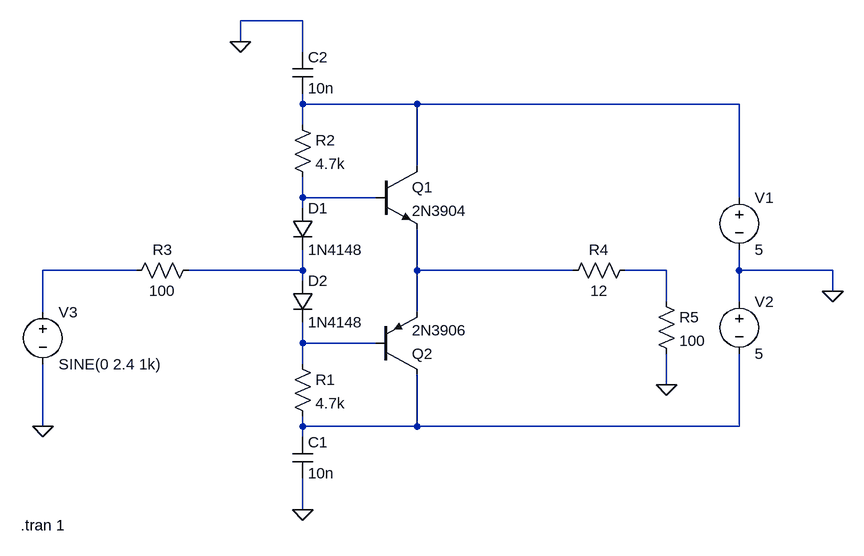
[diagram p0: schematic Push pull amplifier Type AB.asc]
Push pull amplifier Type AB.asc, the LTspice schematic file:
Version 4
SHEET 1 916 680
WIRE 80 -176 -16 -176
WIRE -16 -144 -16 -176
WIRE 80 -128 80 -176
WIRE 80 -48 80 -64
WIRE 256 -48 80 -48
WIRE 752 -48 256 -48
WIRE 80 -16 80 -48
WIRE 256 48 256 -48
WIRE 80 96 80 64
WIRE 192 96 80 96
WIRE 752 96 752 -48
WIRE 80 112 80 96
WIRE -176 208 -320 208
WIRE 80 208 80 176
WIRE 80 208 -96 208
WIRE 256 208 256 144
WIRE 496 208 256 208
WIRE 640 208 576 208
WIRE 752 208 752 176
WIRE 896 208 752 208
WIRE 80 224 80 208
WIRE 896 240 896 208
WIRE 640 256 640 208
WIRE 752 256 752 208
WIRE -320 272 -320 208
WIRE 256 272 256 208
WIRE 80 320 80 288
WIRE 192 320 80 320
WIRE 80 352 80 320
WIRE 640 384 640 336
WIRE -320 448 -320 352
WIRE 80 448 80 432
WIRE 256 448 256 368
WIRE 256 448 80 448
WIRE 752 448 752 336
WIRE 752 448 256 448
WIRE 80 464 80 448
WIRE 80 576 80 528
FLAG -16 -144 0
FLAG 80 576 0
FLAG 896 240 0
FLAG 640 384 0
FLAG -320 448 0
SYMBOL npn 192 48 R0
SYMATTR InstName Q1
SYMATTR Value 2N3904
SYMBOL pnp 192 368 M180
SYMATTR InstName Q2
SYMATTR Value 2N3906
SYMBOL res 64 336 R0
SYMATTR InstName R1
SYMATTR Value 4.7k
SYMBOL res 64 -32 R0
SYMATTR InstName R2
SYMATTR Value 4.7k
SYMBOL res -80 192 R90
WINDOW 0 0 56 VBottom 2
WINDOW 3 32 56 VTop 2
SYMATTR InstName R3
SYMATTR Value 100
SYMBOL res 592 192 R90
WINDOW 0 0 56 VBottom 2
WINDOW 3 32 56 VTop 2
SYMATTR InstName R4
SYMATTR Value 12
SYMBOL cap 64 464 R0
SYMATTR InstName C1
SYMATTR Value 10n
SYMBOL cap 64 -128 R0
SYMATTR InstName C2
SYMATTR Value 10n
SYMBOL voltage 752 80 R0
WINDOW 123 0 0 Left 0
WINDOW 39 0 0 Left 0
SYMATTR InstName V1
SYMATTR Value 5
SYMBOL voltage 752 240 R0
WINDOW 123 0 0 Left 0
WINDOW 39 0 0 Left 0
SYMATTR InstName V2
SYMATTR Value 5
SYMBOL diode 64 112 R0
SYMATTR InstName D1
SYMATTR Value 1N4148
SYMBOL diode 64 224 R0
SYMATTR InstName D2
SYMATTR Value 1N4148
SYMBOL res 624 240 R0
SYMATTR InstName R5
SYMATTR Value 100
SYMBOL voltage -320 256 R0
WINDOW 123 0 0 Left 0
WINDOW 39 0 0 Left 0
SYMATTR InstName V3
SYMATTR Value SINE(0 2.4 1k)
TEXT -354 600 Left 2 !.tran 1

The netlist it stands for:
* Push pull amplifier Type AB.asc
Q1 N001 N002 N005 0 2N3904
Q2 N008 N007 N005 0 2N3906
R1 N007 N008 4.7k
R2 N001 N002 4.7k
R3 N004 N003 100
R4 N006 N005 12
C1 N008 0 10n
C2 0 N001 10n
V1 N001 0 5
V2 0 N008 5
D1 N002 N004 1N4148
D2 N004 N007 1N4148
R5 N006 0 100
V3 N003 0 SINE(0 2.4 1k)
.model D D
.lib standard.dio
.model NPN NPN
.model PNP PNP
.lib standard.bjt
.tran 1
.backanno
.end